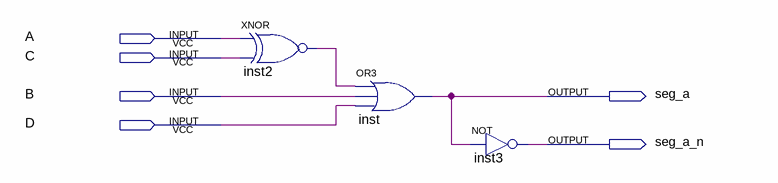
[diagram p0: schematic sheet]
// Quartus schematic segmento_a.bdf as structural Verilog: 3 symbols, 6 pins
module segmento_a (
  input  A,
  input  C,
  input  B,
  input  D,
  output seg_a,
  output seg_a_n
);

  wire inst2_out;

  xnor inst2 (inst2_out, A, C);
  or inst (seg_a, inst2_out, B, D);
  not inst3 (seg_a_n, seg_a);
endmodule
